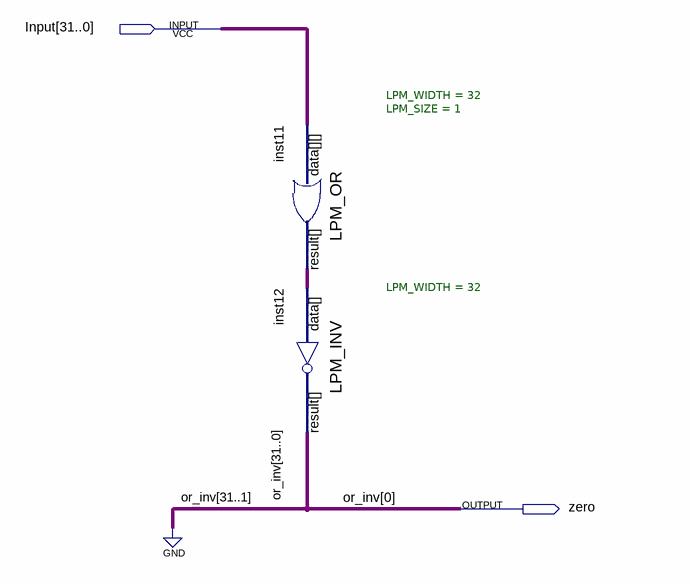
[diagram p0: schematic sheet]
// Quartus schematic nor.bdf as structural Verilog: 2 symbols, 2 pins
module \nor  (
  input  [31:0] Input,
  output zero
);

  wire [31:0] inst11_result;
  wire [31:1] or_inv;

  LPM_OR #(.LPM_WIDTH(32), .LPM_SIZE(1)) inst11 (.data(Input), .result(inst11_result));
  LPM_INV #(.LPM_WIDTH(32)) inst12 (.data(inst11_result), .result({or_inv, zero}));
  // also tied to GND on the sheet: {or_inv[1], or_inv[2], or_inv[3], or_inv[4], or_inv[5], or_inv[6], or_inv[7], or_inv[8], or_inv[9], or_inv[10], or_inv[11], or_inv[12], or_inv[13], or_inv[14], or_inv[15], or_inv[16], or_inv[17], or_inv[18], or_inv[19], or_inv[20], or_inv[21], or_inv[22], or_inv[23], or_inv[24], or_inv[25], or_inv[26], or_inv[27], or_inv[28], or_inv[29], or_inv[30], or_inv[31]}

  // Other names for the same wires on the sheet: or_inv[0] = zero
endmodule
